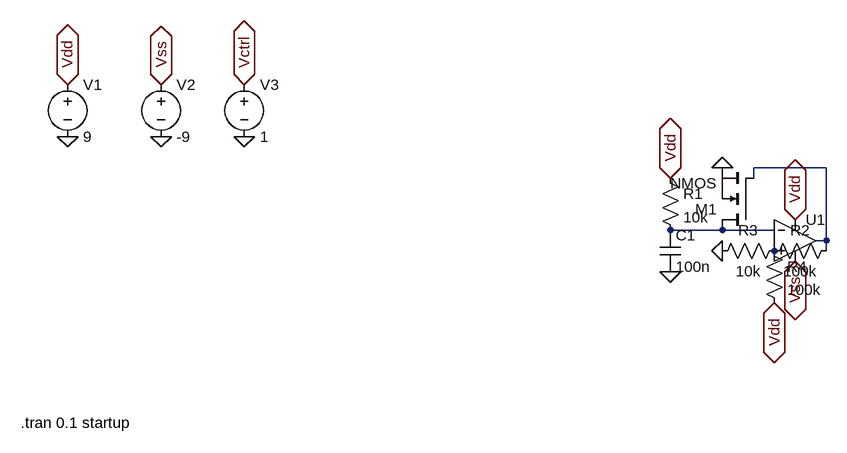
[diagram p0: schematic VCOtest.asc]
VCOtest.asc, the LTspice schematic file:
Version 4
SHEET 1 936 804
WIRE 720 -80 608 -80
WIRE 608 -64 608 -80
WIRE 560 16 480 16
WIRE 640 16 560 16
WIRE 720 32 720 -80
WIRE 720 32 704 32
WIRE 720 48 720 32
FLAG -176 -128 0
FLAG -304 -128 0
FLAG -448 -128 0
FLAG -448 -208 Vdd
IOPIN -448 -208 BiDir
FLAG -304 -208 Vss
IOPIN -304 -208 BiDir
FLAG -176 -208 Vctrl
IOPIN -176 -208 BiDir
FLAG 672 64 Vss
IOPIN 672 64 BiDir
FLAG 672 0 Vdd
IOPIN 672 0 BiDir
FLAG 640 128 Vdd
IOPIN 640 128 BiDir
FLAG 560 48 0
FLAG 480 80 0
FLAG 480 -64 Vdd
IOPIN 480 -64 BiDir
FLAG 560 -80 0
SYMBOL voltage -448 -224 R0
WINDOW 123 0 0 Left 0
WINDOW 39 0 0 Left 0
SYMATTR InstName V1
SYMATTR Value 9
SYMBOL voltage -304 -224 R0
WINDOW 123 0 0 Left 0
WINDOW 39 0 0 Left 0
SYMATTR InstName V2
SYMATTR Value -9
SYMBOL voltage -176 -224 R0
WINDOW 123 0 0 Left 0
WINDOW 39 0 0 Left 0
SYMATTR InstName V3
SYMATTR Value 1
SYMBOL Opamps\\UniversalOpamp2 672 32 R0
SYMATTR InstName U1
SYMBOL res 464 -80 R0
SYMATTR InstName R1
SYMATTR Value 10k
SYMBOL cap 464 16 R0
SYMATTR InstName C1
SYMATTR Value 100n
SYMBOL res 736 32 R90
WINDOW 0 0 56 VBottom 2
WINDOW 3 32 56 VTop 2
SYMATTR InstName R2
SYMATTR Value 100k
SYMBOL res 656 32 R90
WINDOW 0 0 56 VBottom 2
WINDOW 3 32 56 VTop 2
SYMATTR InstName R3
SYMATTR Value 10k
SYMBOL res 624 32 R0
SYMATTR InstName R4
SYMATTR Value 100k
SYMBOL nmos 608 16 R180
SYMATTR InstName M1
TEXT -520 312 Left 2 !.tran 0.1 startup

The netlist it stands for:
* VCOtest.asc
V1 Vdd 0 9
V2 Vss 0 -9
V3 Vctrl 0 1
XU1 P001 N002 Vdd Vss N001 level.2 Avol=1Meg GBW=10Meg Slew=10Meg ilimit=25m rail=0 Vos=0 phimargin=45 en=0 enk=0 in=0 ink=0 Rin=500Meg  ; pins IN+ IN- V+ V- OUT
R1 Vdd N002 10k
C1 N002 0 100n
R2 N001 P001 100k
R3 P001 0 10k
R4 P001 Vdd 100k
M1 N002 N001 0 0 NMOS
.model NMOS NMOS
.model PMOS PMOS
.lib standard.mos
.tran 0.1 startup
.lib UniversalOpamps2.sub
.backanno
.end